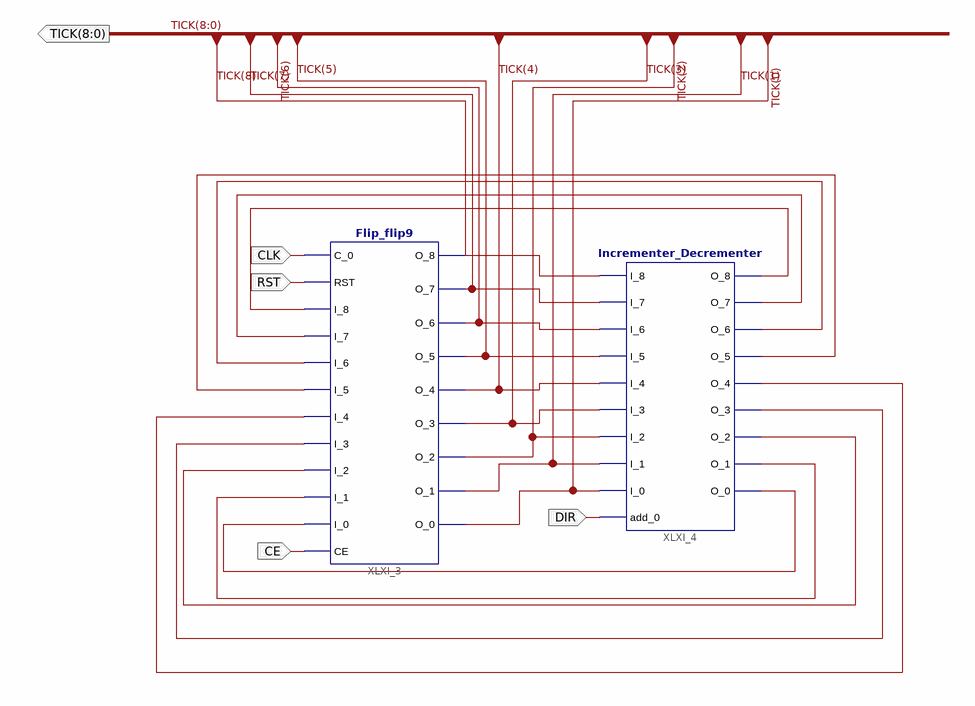
[diagram p0: schematic sheet 1]
// Xilinx ISE schematic Couter_9CE.sch (spartan3e) as structural Verilog: 2 symbols, 5 ports
module Couter_9CE (
  input  DIR,
  input  RST,
  input  CLK,
  input  CE,
  output [8:0] TICK
);

  wire XLXN_1, XLXN_3, XLXN_5, XLXN_7, XLXN_9, XLXN_11, XLXN_12, XLXN_13, XLXN_16;

  Flip_flip9 XLXI_3 (
    .C_0(CLK), .RST(RST), .I_8(XLXN_1), .I_7(XLXN_13), .I_6(XLXN_16), .I_5(XLXN_12), .I_4(XLXN_11),
    .I_3(XLXN_9), .I_2(XLXN_7), .I_0(XLXN_3), .I_1(XLXN_5), .CE(CE), .O_8(TICK[8]), .O_7(TICK[7]),
    .O_6(TICK[6]), .O_5(TICK[5]), .O_4(TICK[4]), .O_3(TICK[3]), .O_2(TICK[2]), .O_1(TICK[1]), .O_0(TICK[0]));
  Incrementer_Decrementer XLXI_4 (
    .add_0(DIR), .I_7(TICK[7]), .I_6(TICK[6]), .I_5(TICK[5]), .I_4(TICK[4]), .I_3(TICK[3]), .I_2(TICK[2]),
    .I_1(TICK[1]), .I_0(TICK[0]), .I_8(TICK[8]), .O_7(XLXN_13), .O_6(XLXN_16), .O_5(XLXN_12), .O_4(XLXN_11),
    .O_3(XLXN_9), .O_2(XLXN_7), .O_1(XLXN_5), .O_0(XLXN_3), .O_8(XLXN_1));
endmodule
